# Altium schematic sheet AMC_Connector.SchDoc: AMC Top Sheet
size A3; DocumentNumber: 1; Revision: 5; SheetNumber: 1; SheetTotal: 30; Organization: Altium Limited.
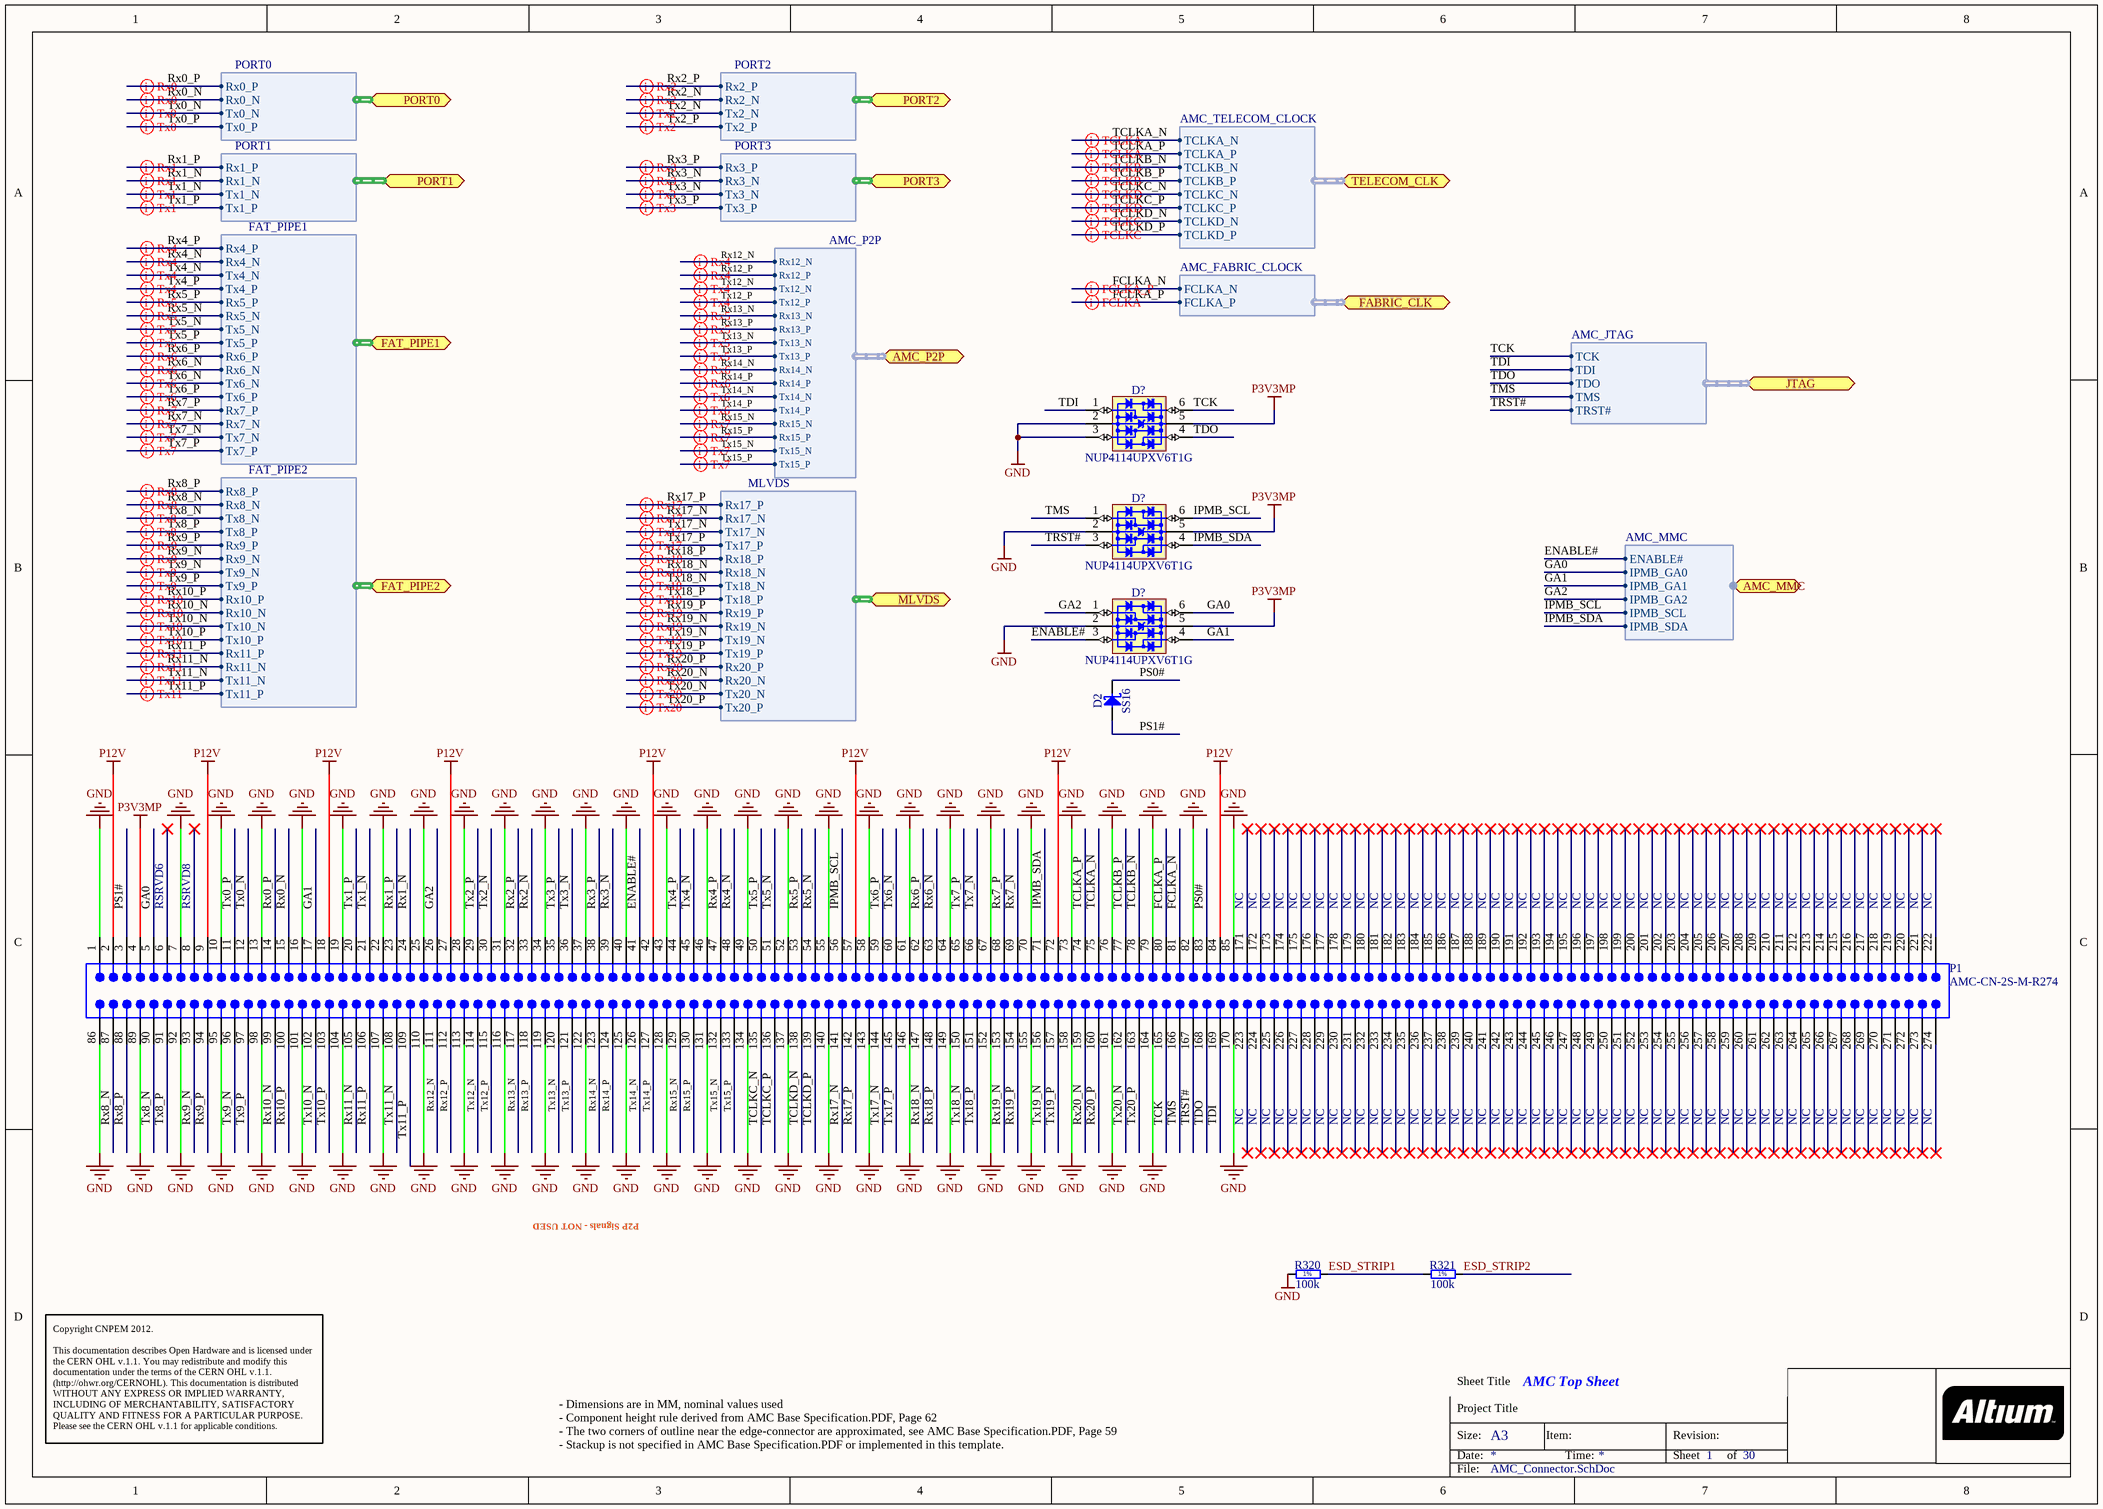
[diagram p0: AMC_Connector.SchDoc]

## Parts
(Parts that share a designator on the sheet are numbered #1, #2 ... from top to bottom, then left to right.)
D2  SS16  [DIOM5127X229N]
D?#1  NUP4114UPXV6T1G  [SOTFL50P160X60-6N]
D?#2  NUP4114UPXV6T1G  [SOTFL50P160X60-6N]
D?#3  NUP4114UPXV6T1G  [SOTFL50P160X60-6N]
P1  AMC-CN-2S-M-R274  [AMC-GF-2D-750-O274]  (no BOM)
R320  100k  [RESC3216X65N]
R321  100k  [RESC3216X65N]

## Ports
AMC_MMC (harness AMC_MMC), AMC_P2P (harness AMC_P2P), FABRIC_CLK (harness AMC_FABRIC_CLOCK), FAT_PIPE1 (harness FAT_PIPE1), FAT_PIPE2 (harness FAT_PIPE2), JTAG (harness AMC_JTAG), MLVDS (harness MLVDS), PORT0 (harness PORT0), PORT1 (harness PORT1), PORT2 (harness PORT2), PORT3 (harness PORT3), TELECOM_CLK (harness AMC_TELECOM_CLOCK)

## Harnesses
AMC_JTAG: TCK, TDI, TDO, TMS, TRST#
AMC_TELECOM_CLOCK: TCLKA_N, TCLKA_P, TCLKB_N, TCLKB_P, TCLKC_N, TCLKC_P, TCLKD_N, TCLKD_P
AMC_FABRIC_CLOCK: FCLKA_N, FCLKA_P
PORT0: Rx0_P, Rx0_N, Tx0_N, Tx0_P
PORT1: Rx1_P, Rx1_N, Tx1_N, Tx1_P
FAT_PIPE1: Rx4_P, Rx4_N, Tx4_N, Tx4_P, Rx5_P, Rx5_N, Tx5_N, Tx5_P, Rx6_P, Rx6_N, Tx6_N, Tx6_P, Rx7_P, Rx7_N, Tx7_N, Tx7_P
FAT_PIPE2: Rx8_P, Rx8_N, Tx8_N, Tx8_P, Rx9_P, Rx9_N, Tx9_N, Tx9_P, Rx10_P, Rx10_N, Tx10_N, Tx10_P, Rx11_P, Rx11_N, Tx11_N, Tx11_P
MLVDS: Rx17_P, Rx17_N, Tx17_N, Tx17_P, Rx18_P, Rx18_N, Tx18_N, Tx18_P, Rx19_P, Rx19_N, Tx19_N, Tx19_P, Rx20_P, Rx20_N, Tx20_N, Tx20_P
PORT2: Rx2_P, Rx2_N, Tx2_N, Tx2_P
PORT3: Rx3_P, Rx3_N, Tx3_N, Tx3_P
AMC_P2P: Rx12_N, Rx12_P, Tx12_N, Tx12_P, Rx13_N, Rx13_P, Tx13_N, Tx13_P, Rx14_N, Rx14_P, Tx14_N, Tx14_P, Rx15_N, Rx15_P, Tx15_N, Tx15_P
AMC_MMC: ENABLE#, IPMB_GA0, IPMB_GA1, IPMB_GA2, IPMB_SCL, IPMB_SDA

## Nets
GND: D?#1.2(GND) D?#1.3(I/O2) D?#2.2(GND) D?#3.2(GND) P1.1 P1.7 P1.10 P1.13 P1.16 P1.19 P1.22 P1.25 P1.28 P1.31 P1.34 P1.37 P1.40 P1.43 P1.46 P1.49 P1.52 P1.55 P1.58 P1.61 P1.64 P1.67 P1.70 P1.73 P1.76 P1.79 P1.82 P1.85 P1.86 P1.89 P1.92 P1.95 P1.98 P1.101 P1.104 P1.107 P1.110 P1.113 P1.116 P1.119 P1.122 P1.125 P1.128 P1.131 P1.134 P1.137 P1.140 P1.143 P1.146 P1.149 P1.152 P1.155 P1.158 P1.161 P1.164 P1.170 R320.1
P3V3MP: D?#1.5(VBUS) D?#2.5(VBUS) D?#3.5(VBUS) P1.4
P12V: P1.2 P1.9 P1.18 P1.27 P1.42 P1.57 P1.72 P1.84
ENABLE#: D?#3.3(I/O2) P1.41 ; port AMC_MMC.ENABLE#
ESD_STRIP1: R320.2 R321.1
ESD_STRIP2: R321.2
FCLKA_N: P1.81 ; port FABRIC_CLK.FCLKA_N
FCLKA_P: P1.80 ; port FABRIC_CLK.FCLKA_P
GA0: D?#3.6(I/O4) P1.5 ; port AMC_MMC.IPMB_GA0
GA1: D?#3.4(I/O3) P1.17 ; port AMC_MMC.IPMB_GA1
GA2: D?#3.1(I/O1) P1.26 ; port AMC_MMC.IPMB_GA2
IPMB_SCL: D?#2.6(I/O4) P1.56 ; port AMC_MMC.IPMB_SCL
IPMB_SDA: D?#2.4(I/O3) P1.71 ; port AMC_MMC.IPMB_SDA
PS0#: D2.1(C) P1.83
PS1#: D2.2(A) P1.3
Rx0_N: P1.15 ; port PORT0.Rx0_N
Rx0_P: P1.14 ; port PORT0.Rx0_P
Rx1_N: P1.24 ; port PORT1.Rx1_N
Rx1_P: P1.23 ; port PORT1.Rx1_P
Rx2_N: P1.33 ; port PORT2.Rx2_N
Rx2_P: P1.32 ; port PORT2.Rx2_P
Rx3_N: P1.39 ; port PORT3.Rx3_N
Rx3_P: P1.38 ; port PORT3.Rx3_P
Rx4_N: P1.48 ; port FAT_PIPE1.Rx4_N
Rx4_P: P1.47 ; port FAT_PIPE1.Rx4_P
Rx5_N: P1.54 ; port FAT_PIPE1.Rx5_N
Rx5_P: P1.53 ; port FAT_PIPE1.Rx5_P
Rx6_N: P1.63 ; port FAT_PIPE1.Rx6_N
Rx6_P: P1.62 ; port FAT_PIPE1.Rx6_P
Rx7_N: P1.69 ; port FAT_PIPE1.Rx7_N
Rx7_P: P1.68 ; port FAT_PIPE1.Rx7_P
Rx8_N: P1.87 ; port FAT_PIPE2.Rx8_N
Rx8_P: P1.88 ; port FAT_PIPE2.Rx8_P
Rx9_N: P1.93 ; port FAT_PIPE2.Rx9_N
Rx9_P: P1.94 ; port FAT_PIPE2.Rx9_P
Rx10_N: P1.99 ; port FAT_PIPE2.Rx10_N
Rx10_P: P1.100 ; port FAT_PIPE2.Rx10_P
Rx11_N: P1.105 ; port FAT_PIPE2.Rx11_N
Rx11_P: P1.106 ; port FAT_PIPE2.Rx11_P
Rx12_N: P1.111 ; port AMC_P2P.Rx12_N
Rx12_P: P1.112 ; port AMC_P2P.Rx12_P
Rx13_N: P1.117 ; port AMC_P2P.Rx13_N
Rx13_P: P1.118 ; port AMC_P2P.Rx13_P
Rx14_N: P1.123 ; port AMC_P2P.Rx14_N
Rx14_P: P1.124 ; port AMC_P2P.Rx14_P
Rx15_N: P1.129 ; port AMC_P2P.Rx15_N
Rx15_P: P1.130 ; port AMC_P2P.Rx15_P
Rx17_N: P1.141 ; port MLVDS.Rx17_N
Rx17_P: P1.142 ; port MLVDS.Rx17_P
Rx18_N: P1.147 ; port MLVDS.Rx18_N
Rx18_P: P1.148 ; port MLVDS.Rx18_P
Rx19_N: P1.153 ; port MLVDS.Rx19_N
Rx19_P: P1.154 ; port MLVDS.Rx19_P
Rx20_N: P1.159 ; port MLVDS.Rx20_N
Rx20_P: P1.160 ; port MLVDS.Rx20_P
TCK: D?#1.6(I/O4) P1.165 ; port JTAG.TCK
TCLKA_N: P1.75 ; port TELECOM_CLK.TCLKA_N
TCLKA_P: P1.74 ; port TELECOM_CLK.TCLKA_P
TCLKB_N: P1.78 ; port TELECOM_CLK.TCLKB_N
TCLKB_P: P1.77 ; port TELECOM_CLK.TCLKB_P
TCLKC_N: P1.135 ; port TELECOM_CLK.TCLKC_N
TCLKC_P: P1.136 ; port TELECOM_CLK.TCLKC_P
TCLKD_N: P1.138 ; port TELECOM_CLK.TCLKD_N
TCLKD_P: P1.139 ; port TELECOM_CLK.TCLKD_P
TDI: D?#1.1(I/O1) P1.169 ; port JTAG.TDI
TDO: D?#1.4(I/O3) P1.168 ; port JTAG.TDO
TMS: D?#2.1(I/O1) P1.166 ; port JTAG.TMS
TRST#: D?#2.3(I/O2) P1.167 ; port JTAG.TRST#
Tx0_N: P1.12 ; port PORT0.Tx0_N
Tx0_P: P1.11 ; port PORT0.Tx0_P
Tx1_N: P1.21 ; port PORT1.Tx1_N
Tx1_P: P1.20 ; port PORT1.Tx1_P
Tx2_N: P1.30 ; port PORT2.Tx2_N
Tx2_P: P1.29 ; port PORT2.Tx2_P
Tx3_N: P1.36 ; port PORT3.Tx3_N
Tx3_P: P1.35 ; port PORT3.Tx3_P
Tx4_N: P1.45 ; port FAT_PIPE1.Tx4_N
Tx4_P: P1.44 ; port FAT_PIPE1.Tx4_P
Tx5_N: P1.51 ; port FAT_PIPE1.Tx5_N
Tx5_P: P1.50 ; port FAT_PIPE1.Tx5_P
Tx6_N: P1.60 ; port FAT_PIPE1.Tx6_N
Tx6_P: P1.59 ; port FAT_PIPE1.Tx6_P
Tx7_N: P1.66 ; port FAT_PIPE1.Tx7_N
Tx7_P: P1.65 ; port FAT_PIPE1.Tx7_P
Tx8_N: P1.90 ; port FAT_PIPE2.Tx8_N
Tx8_P: P1.91 ; port FAT_PIPE2.Tx8_P
Tx9_N: P1.96 ; port FAT_PIPE2.Tx9_N
Tx9_P: P1.97 ; port FAT_PIPE2.Tx9_P
Tx10_N: P1.102 ; port FAT_PIPE2.Tx10_N
Tx10_P: P1.103 ; port FAT_PIPE2.Tx10_P
Tx11_N: P1.108 ; port FAT_PIPE2.Tx11_N
Tx11_P: P1.109 ; port FAT_PIPE2.Tx11_P
Tx12_N: P1.114 ; port AMC_P2P.Tx12_N
Tx12_P: P1.115 ; port AMC_P2P.Tx12_P
Tx13_N: P1.120 ; port AMC_P2P.Tx13_N
Tx13_P: P1.121 ; port AMC_P2P.Tx13_P
Tx14_N: P1.126 ; port AMC_P2P.Tx14_N
Tx14_P: P1.127 ; port AMC_P2P.Tx14_P
Tx15_N: P1.132 ; port AMC_P2P.Tx15_N
Tx15_P: P1.133 ; port AMC_P2P.Tx15_P
Tx17_N: P1.144 ; port MLVDS.Tx17_N
Tx17_P: P1.145 ; port MLVDS.Tx17_P
Tx18_N: P1.150 ; port MLVDS.Tx18_N
Tx18_P: P1.151 ; port MLVDS.Tx18_P
Tx19_N: P1.156 ; port MLVDS.Tx19_N
Tx19_P: P1.157 ; port MLVDS.Tx19_P
Tx20_N: P1.162 ; port MLVDS.Tx20_N
Tx20_P: P1.163 ; port MLVDS.Tx20_P

Not connected (* = marked no-connect by the designer): P1 6* 8* 171* 172* 173* 174* 175* 176* 177* 178* 179* 180* 181* 182* 183* 184* 185* 186* 187* 188* 189* 190* 191* 192* 193* 194* 195* 196* 197* 198* 199* 200* 201* 202* 203* 204* 205* 206* 207* 208* 209* 210* 211* 212* 213* 214* 215* 216* 217* 218* 219* 220* 221* 222* 223* 224* 225* 226* 227* 228* 229* 230* 231* 232* 233* 234* 235* 236* 237* 238* 239* 240* 241* 242* 243* 244* 245* 246* 247* 248* 249* 250* 251* 252* 253* 254* 255* 256* 257* 258* 259* 260* 261* 262* 263* 264* 265* 266* 267* 268* 269* 270* 271* 272* 273* 274*

## Layout directives
differential pair: FCLKA_N, FCLKA_P, Rx0_N, Rx0_P, Rx1_N, Rx1_P, Rx2_N, Rx2_P, Rx3_N, Rx3_P, Rx4_N, Rx4_P, Rx5_N, Rx5_P, Rx6_N, Rx6_P, Rx7_N, Rx7_P, Rx8_N, Rx8_P, Rx9_N, Rx9_P, Rx10_N, Rx10_P, Rx11_N, Rx11_P, Rx12_N, Rx12_P, Rx13_N, Rx13_P, Rx14_N, Rx14_P, Rx15_N, Rx15_P, Rx17_N, Rx17_P, Rx18_N, Rx18_P, Rx19_N, Rx19_P, Rx20_N, Rx20_P, TCLKA_N, TCLKA_P, TCLKB_N, TCLKB_P, TCLKC_N, TCLKC_P, TCLKD_N, TCLKD_P, Tx0_N, Tx0_P, Tx1_N, Tx1_P, Tx2_N, Tx2_P, Tx3_N, Tx3_P, Tx4_N, Tx4_P, Tx5_N, Tx5_P, Tx6_N, Tx6_P, Tx7_N, Tx7_P, Tx8_N, Tx8_P, Tx9_N, Tx9_P, Tx10_N, Tx10_P, Tx11_N, Tx11_P, Tx12_N, Tx12_P, Tx13_N, Tx13_P, Tx14_N, Tx14_P, Tx15_N, Tx15_P, Tx17_N, Tx17_P, Tx18_N, Tx18_P, Tx19_N, Tx19_P, Tx20_N, Tx20_P

## Notes on the sheet
- RSRVD6
- RSRVD8
- NC
- P2P Signals - NOT USED
- Copyright CNPEM 2012.
  This documentation describes Open Hardware and is licensed under the CERN OHL v.1.1. You may redistribute and modify this documentation under the terms of the CERN OHL v.1.1. (http://ohwr.org/CERNOHL). This documentation is distributed WITHOUT ANY EXPRESS OR IMPLIED WARRANTY, INCLUDING OF MERCHANTABILITY, SATISFACTORY QUALITY AND FITNESS FOR A PARTICULAR PURPOSE. Please see the CERN OHL v.1.1 for applicable conditions.
- - Dimensions are in MM, nominal values used
  - Component height rule derived from AMC Base Specification.PDF, Page 62
  - The two corners of outline near the edge-connector are approximated, see AMC Base Specification.PDF, Page 59
  - Stackup is not specified in AMC Base Specification.PDF or implemented in this template.
- Sheet Title
- Project Title
- Size:
- Date:
- A3
- Item:
- Time:
- Revision:
- Sheet
- of
- File:
- (in symbol R1206_100K_1%_0.25W_100PPM) 1%

## Library data of the parts
D2 = SS16: Schottky Diode; Part Description: Surface Mount Schottky Barrier Rectifier; Manufacturer: VISHAY GENERAL SEMICONDUCTOR; Voltage: 60V; Power: 1A; Table: Diodes; Part Number: SS16; Component Kind: Standard; Component Type: Standard; Device: SS16; PackageDescription: DO-214-AC Molded Diode, Body 5.1x2.7mm, IPC Medium Density; Manufacturer Part Number: SS16; Pin Count: 2; Case: DO-214AC; Mounted: Yes; Socket: No; SMD: Yes; ComponentHeight: 2.29mm; HelpURL: \\cern.ch\dfs\Applications\Altium\Datasheets\SS16.pdf; Author: CERN DEM JLC; CreateDate: 2008-07-15; LatestRevisionDate: 2010-08-23
D?#1-D?#3 = NUP4114UPXV6T1G: Part Description: ESD Protection Diodes Array (8kV) with Low Clamping Voltage; Manufacturer: ON SEMICONDUCTOR; Voltage: 5.5V; PressFit: No; Bonding: No; Part Number: NUP4114UPXV6T1G; Component Kind: Standard; Component Type: Standard; Device: NUP4114UPXV6T1G; PackageDescription: SOTFL (SOT666, SOT563,), 0.50mm, Pitch; 6 Pin, 1.20mm W X 1.60mm L X 0.60mm H Body, IPC Medium Density; Manufacturer Part Number: NUP4114UPXV6T1G; Pin Count: 8; Mounted: Yes; Socket: No; SMD: Yes; Sense: No; ComponentHeight: 1.75mm; HelpURL: \\cern.ch\dfs\Applications\Altium\Datasheets\NUP4114UPXV6T1G.pdf; Author: CERN DEM JLC; CreateDate: 05/12/2012; LatestRevisionDate: 05/12/2012
P1 = CMP-0001-00058-2: Golden finger, AMC, Dual, Opposite, Pitch 0.75mm, 170-Position; Package Version: rev2.0, Nov-2006; Mating Connector: Molex-0758000001; Datasheet Version: rev2.0, Nov-2006; ClassName: Edge Connector; Package Reference: AMC-GF-2D-750-O274; Publisher: Altium
R320 R321 = R1206_100K_1%_0.25W_100PPM: Resistor - 1%; Part Description: General Purpose Thick Film Chip Resistor; Manufacturer: GENERIC; Manufacturer1 Part Number: NRC12F1003TRF; Power: 0.25W; TC: ±100ppm/°C; Table: Resistors SMD; Part Number: R1206_100K_1%_0.25W_100PPM; Component Kind: Standard; Component Type: Standard; Pin Count: 2; Value: 100k; Status: Preferred; Tolerance: ±1%; Manufacturer Part Number: R1206_100K_1%_0.25W_100PPM; Case: 1206; Mounted: Yes; Socket: No; SMD: Yes; Manufacturer1 Example: NIC COMPONENT; Manufacturer1 ComponentHeight: 0.65mm; HelpURL: \\cern.ch\dfs\Applications\Altium\Datasheets\R1206_NIC_NRC.pdf; Author: CERN DEM JLC; CreateDate: 2007-12-03; LatestRevisionDate: 2008-03-13